# Altium project DATN.PrjPcb
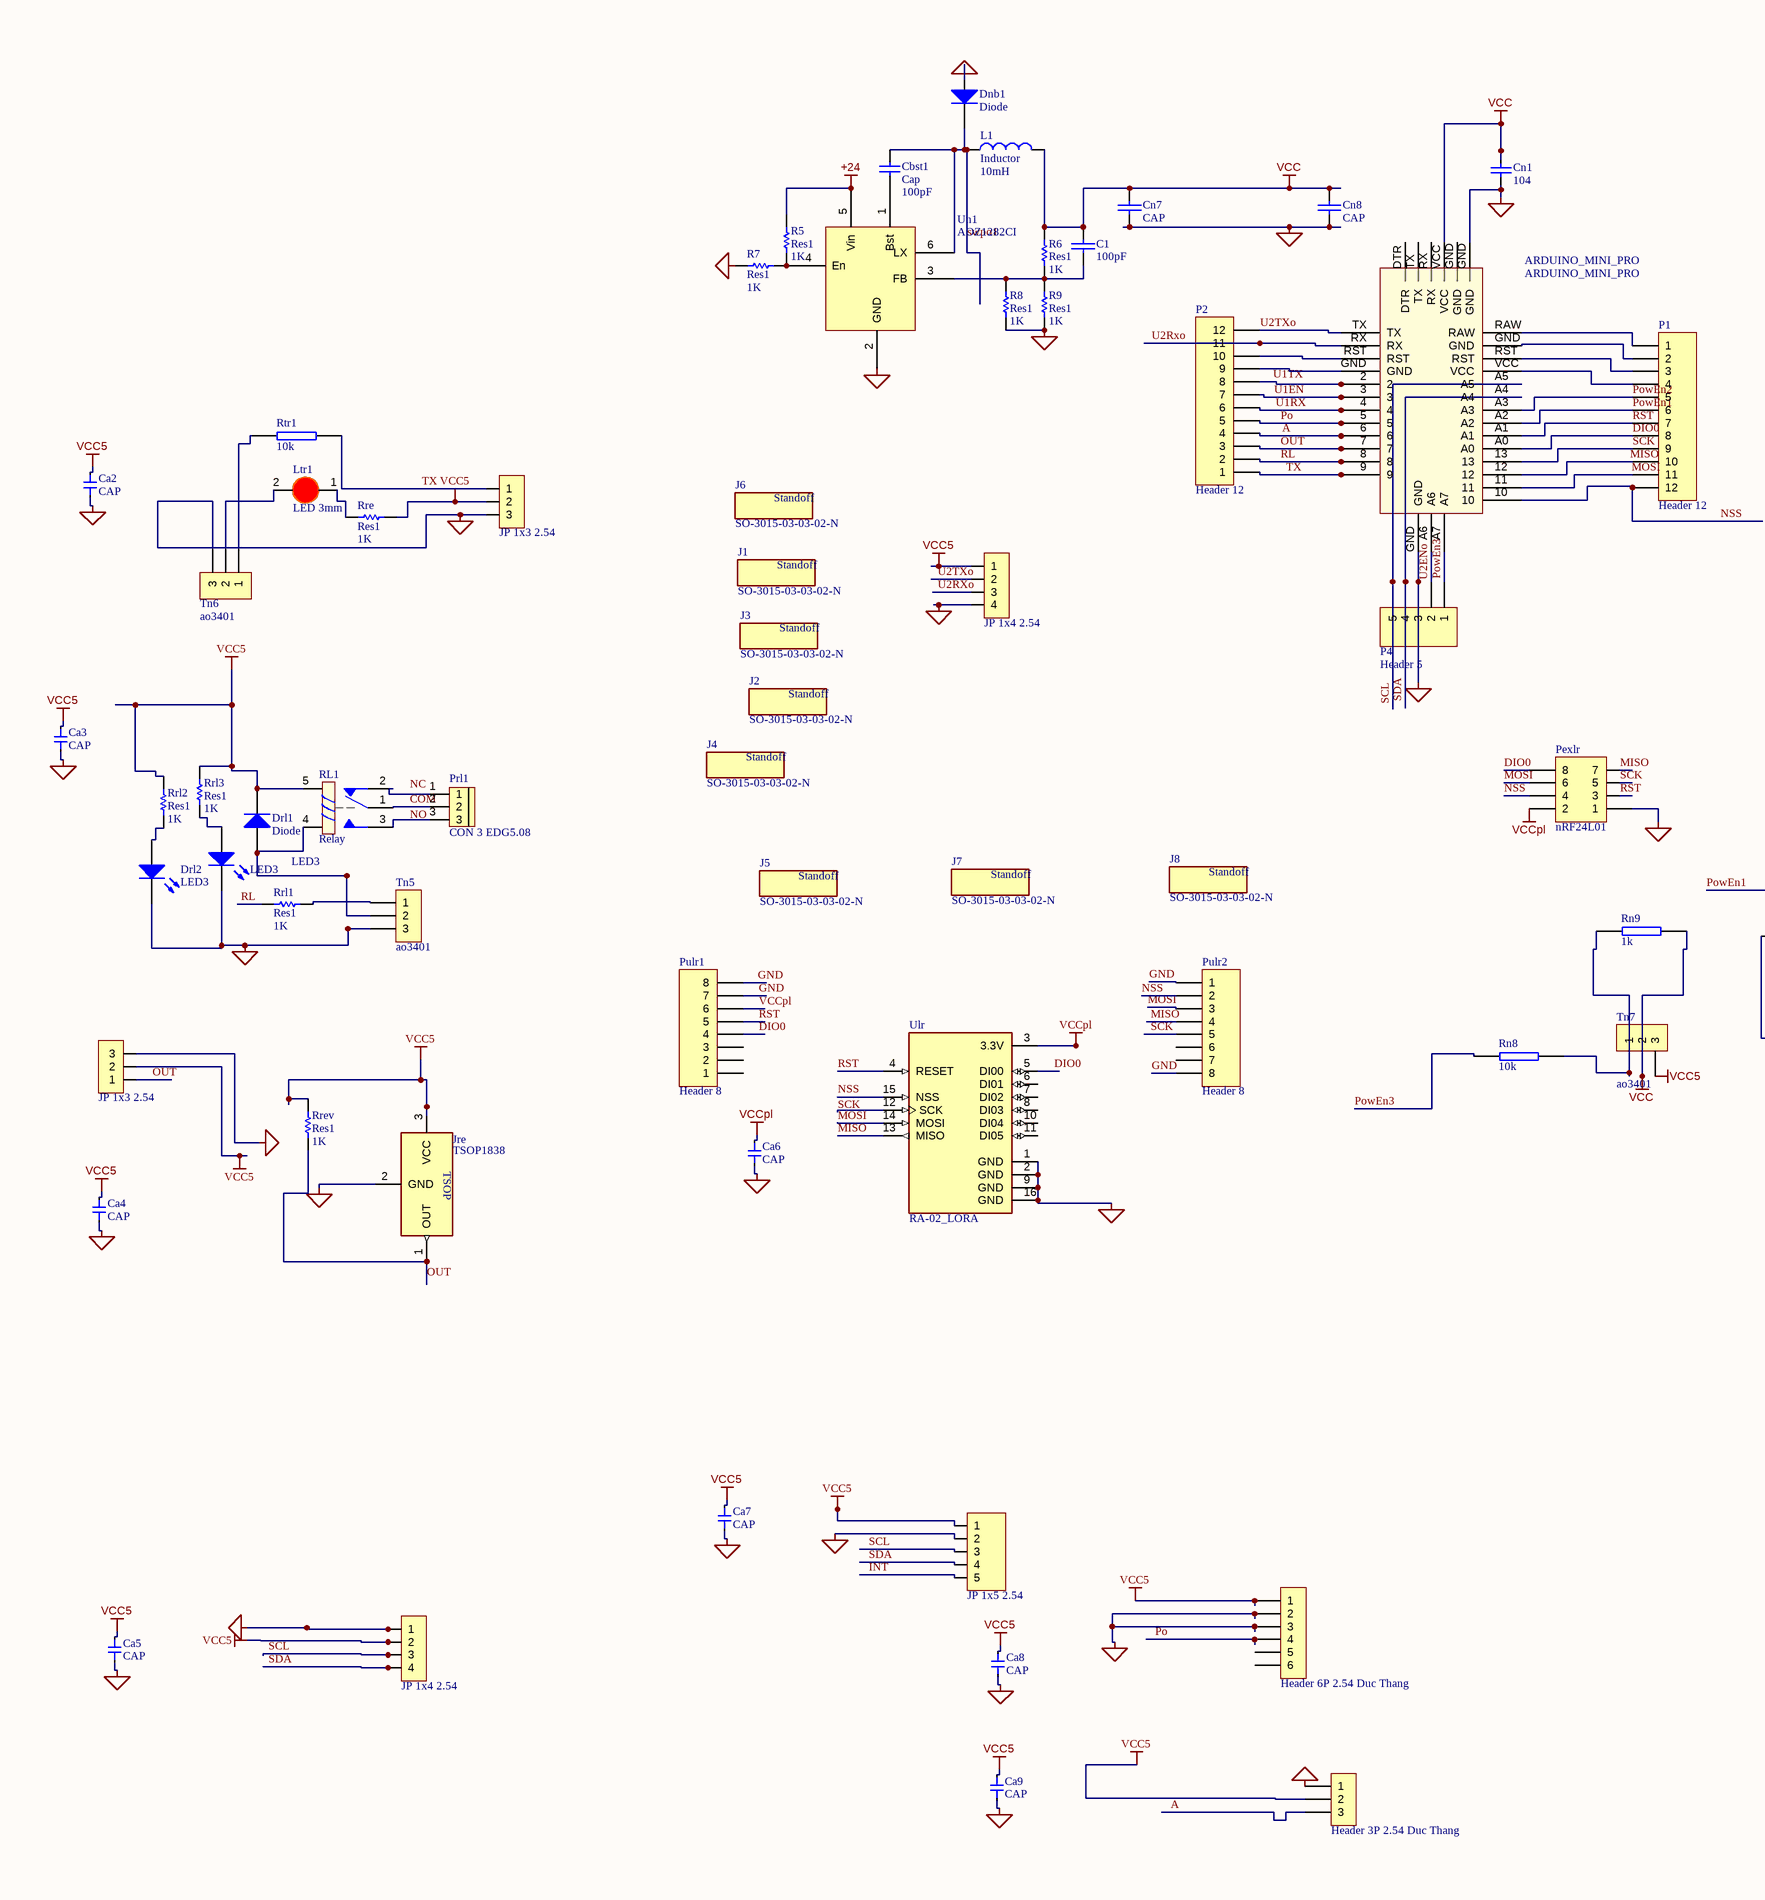
[diagram p0: Sheet1.SchDoc, left]
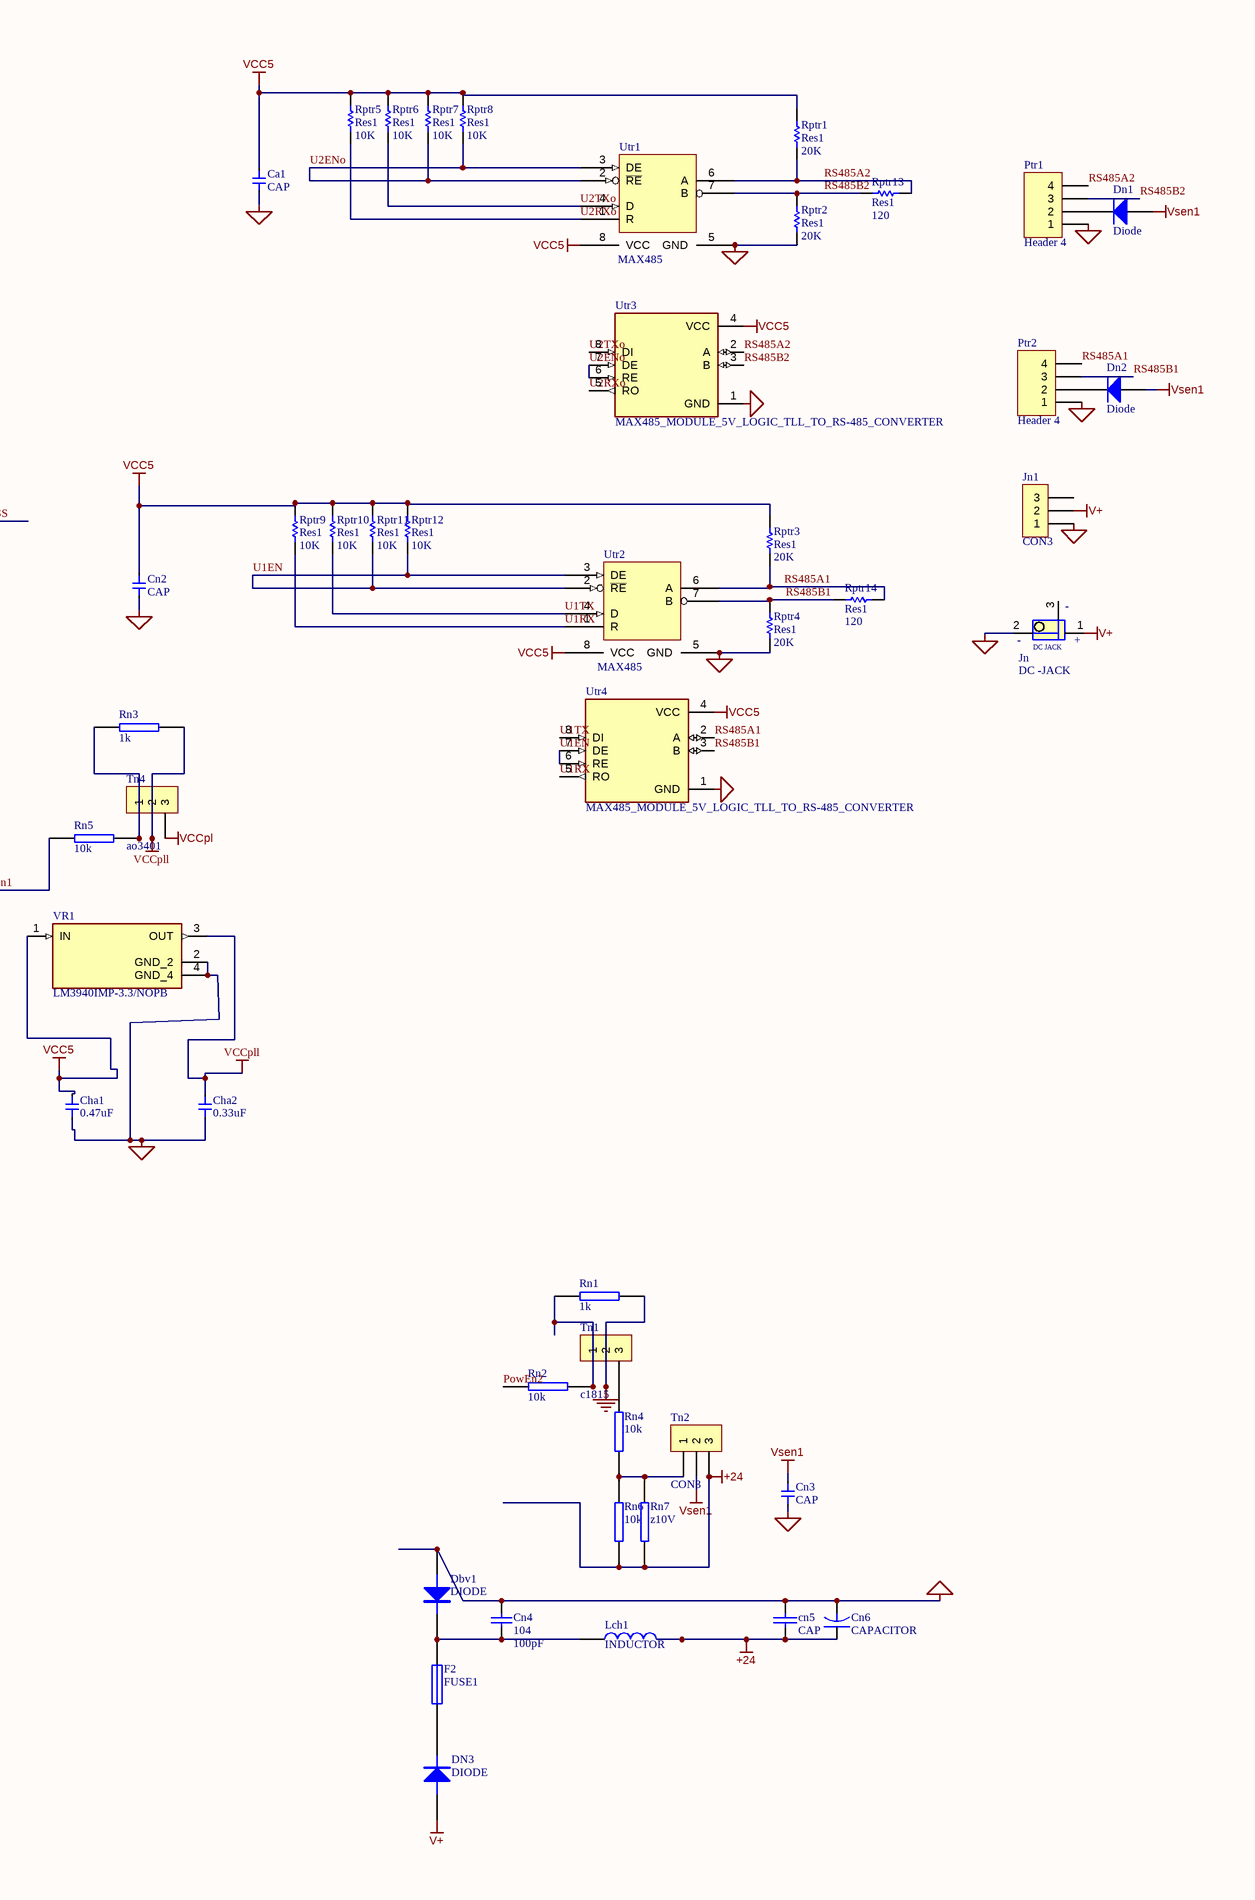
[diagram p1: Sheet1.SchDoc, right]
1 sheet, 109 parts. Net scope: global (net labels, ports and power ports of the same name join across sheets).
Board file: PCB1.PcbDoc

## Sheet Sheet1.SchDoc
size 594 x 420 mm; SheetNumber: 1; SheetTotal: 1; SPICEModelCacheKOELNJHK: <root> / <DocumentId>KOELNJHK</DocumentId> / <CacheFrame Number="0"> / <Model Name="diode" Kind="MDL"> / <Text>*Default Diode / *Diode Pinout: A,K / .MODEL DIODE D()</Text> / </Model> / </CacheFrame> / </root>

### Parts
ARDUINO_MINI_PRO  ARDUINO_MINI_PRO  [ARDUINO_MINI_PRO]
C1  100pF  [1206e]
Ca1  CAP  [Cap 0805]
Ca2  CAP  [Cap 0805]
Ca3  CAP  [Cap 0805]
Ca4  CAP  [Cap 0805]
Ca5  CAP  [Cap 0805]
Ca6  CAP  [Cap 0805]
Ca7  CAP  [Cap 0805]
Ca8  CAP  [Cap 0805]
Ca9  CAP  [Cap 0805]
Cbst1  Cap  value 100pF  [0805c]
Cha1  0.47uF  [Cap 0805]
Cha2  0.33uF  [Cap 0805]
Cn1  104  [0805c]
Cn2  CAP  [Cap 0805]
Cn3  CAP  [Cap 1206]
Cn4  104  value 100pF  [0805c]
cn5  CAP  [1206e]
Cn6  CAPACITOR  [cc15r15]
Cn7  CAP  [1206e]
Cn8  CAP  [1206e]
Dbv1  DIODE  [smb]
Dn1  Diode  [Sma]
Dn2  Diode  [Sma]
DN3  DIODE  [sma]
Dnb1  Diode  [Sma]
Drl1  Diode  [SMC]
Drl2  LED3  [3.5X2.8X1.9]
F2  FUSE1  [FuseSMD050]
H1  Header 3P 2.54 Duc Thang  [XH2.54M-3]
H2  Header 6P 2.54 Duc Thang  [XH2.54M-6]
J1  SO-3015-03-03-02-N  [SAMTEC_SO-3015-03-03-02-N]
J2  SO-3015-03-03-02-N  [SAMTEC_SO-3015-03-03-02-N]
J3  SO-3015-03-03-02-N  [SAMTEC_SO-3015-03-03-02-N]
J4  SO-3015-03-03-02-N  [SAMTEC_SO-3015-03-03-02-N]
J5  SO-3015-03-03-02-N  [SAMTEC_SO-3015-03-03-02-N]
J6  SO-3015-03-03-02-N  [SAMTEC_SO-3015-03-03-02-N]
J7  SO-3015-03-03-02-N  [SAMTEC_SO-3015-03-03-02-N]
J8  SO-3015-03-03-02-N  [SAMTEC_SO-3015-03-03-02-N]
Jn  DC -JACK  [CON3_129_PJ-002A_TH_RA]
Jn1  CON3  [giacdung3]
JPas  JP 1x5 2.54  [JP 1x5 CT]
JPrev  JP 1x3 2.54  [JP 1x3 CT]
JPsc  JP 1x4 2.54  [JP 1x4 CT]
JPsc4  JP 1x4 2.54  [JP 1x4 CT]
JPtr  JP 1x3 2.54  [JP 1x3 CT]
Jre  TSOP1838  [TSOP1838]
L1  Inductor  value 10mH  [IND_SPR06xe]
Lch1  INDUCTOR  [IND_SPR05x]
LED3  LED3  [3.5X2.8X1.9]
Ltr1  LED 3mm  [LED-3MM-RED]
P1  Header 12  [HDR1X12]
P2  Header 12  [HDR1X12]
P4  Header 5  [HDR1X5]
Pexlr  nRF24L01  [HDR2X4]
Prl1  CON 3 EDG5.08  [CON 3 3EDG5.08]
Ptr1  Header 4  [giacdung4]
Ptr2  Header 4  [giacdung4]
Pulr1  Header 8  [HDR1X8]
Pulr2  Header 8  [HDR1X8]
R5  Res1  value 1K  [0805c]
R6  Res1  value 1K  [0805c]
R7  Res1  value 1K  [0805c]
R8  Res1  value 1K  [0805c]
R9  Res1  value 1K  [0805c]
RL1  Relay  [Relay 5 Chan SRD]
Rn1  1k  [0805c]
Rn2  10k  [0805c]
Rn3  1k  [0805c]
Rn4  10k  [0805c]
Rn5  10k  [0805c]
Rn6  10k  [0805c]
Rn7  z10V  [1206]
Rn8  10k  [0805c]
Rn9  1k  [0805c]
Rptr1  Res1  value 20K  [0805c]
Rptr2  Res1  value 20K  [0805c]
Rptr3  Res1  value 20K  [0805c]
Rptr4  Res1  value 20K  [0805c]
Rptr5  Res1  value 10K  [0805c]
Rptr6  Res1  value 10K  [0805c]
Rptr7  Res1  value 10K  [0805c]
Rptr8  Res1  value 10K  [0805c]
Rptr9  Res1  value 10K  [0805c]
Rptr10  Res1  value 10K  [0805c]
Rptr11  Res1  value 10K  [0805c]
Rptr12  Res1  value 10K  [0805c]
Rptr13  Res1  value 120  [0805c]
Rptr14  Res1  value 120  [0805c]
Rre  Res1  value 1K  [0805c]
Rrev  Res1  value 1K  [0805c]
Rrl1  Res1  value 1K  [0805c]
Rrl2  Res1  value 1K  [0805c]
Rrl3  Res1  value 1K  [0805c]
Rtr1  10k  [0805c]
Tn1  c1815  [sot23-3]
Tn2  CON3  [dpak]
Tn4  ao3401  [sot23-3]
Tn5  ao3401  [sot23-3]
Tn6  ao3401  [sot23-3]
Tn7  ao3401  [sot23-3]
Ulr  RA-02_LORA  [MODULE_RA-02_LORA]
Un1  AOZ1282CI  [Sot23-6]
Utr1  MAX485  [so-8]
Utr2  MAX485  [so-8]
Utr3  MAX485_MODULE_5V_LOGIC_TLL_TO_RS-485_CONVERTER  [MODULE_MAX485_MODULE_5V_LOGIC_TLL_TO_RS-485_CONVERTER]
Utr4  MAX485_MODULE_5V_LOGIC_TLL_TO_RS-485_CONVERTER  [MODULE_MAX485_MODULE_5V_LOGIC_TLL_TO_RS-485_CONVERTER]
VR1  LM3940IMP-3.3/NOPB  [VREG_LM3940IMP-3.3/NOPB]

### Nets
+24: cn5.1 Cn6.1 Lch1.2 R5.1 Rn6.1 Rn7.1 Tn2.3 Un1.5(Vin)
GND: ARDUINO_MINI_PRO.GND Ca1.2 Ca2.2 Ca3.2 Ca4.2 Ca5.2 Ca6.2 Ca7.2 Ca8.2 Ca9.2 Cha1.2 Cha2.2 Cn1.1 Cn2.2 Cn3.2 Cn4.2 cn5.2 Cn6.2 Cn7.2 Cn8.2 Dbv1.1(A) Dnb1.1(A) Drl2.2(K) H1.1 H2.2 H2.3 Jn.2 Jn1.1 JPas.2 JPrev.3 JPsc.1 JPsc4.4 JPtr.3 Jre.2(GND) LED3.2(K) P4.3 Pexlr.1 Ptr1.1 Ptr2.1 Pulr1.7 Pulr1.8 Pulr2.1 Pulr2.8 R7.1 R8.1 R9.1 Rn1.2 Rptr2.1 Rptr4.1 Tn1.2 Tn5.3 Tn6.3 Ulr.1(GND) Ulr.2(GND) Ulr.9(GND) Ulr.16(GND) Un1.2(GND) Utr1.5(GND) Utr2.5(GND) Utr3.1(GND) Utr4.1(GND) VR1.2(GND_2) VR1.4(GND_4)
V+: DN3.1(A) Jn.1 Jn1.2
VCC: ARDUINO_MINI_PRO.VCC C1.1 Ca1.1 Ca2.1 Ca3.1 Ca4.1 Ca5.1 Ca7.1 Ca8.1 Ca9.1 Cha1.1 Cn1.2 Cn2.1 Cn7.1 Cn8.1 Drl1.2(K) H1.2 H2.1 JPas.1 JPrev.2 JPsc.2 JPsc4.1 JPtr.2 Jre.3(VCC) L1.2 R6.1 RL1.5 Rn9.2 Rptr1.1 Rptr3.1 Rptr5.1 Rptr6.1 Rptr7.1 Rptr8.1 Rptr9.1 Rptr10.1 Rptr11.1 Rptr12.1 Rre.2 Rrev.2 Rrl2.2 Rrl3.2 Tn7.2 Tn7.3 Utr1.8(VCC) Utr2.8(VCC) Utr3.4(VCC) Utr4.4(VCC) VR1.1(IN)  [also labelled VCC5]
VCCpl: Ca6.1 Pexlr.2 Pulr1.6 Tn4.3 Ulr.3(3.3V)
VCCpll: Cha2.1 Rn3.2 Tn4.2 VR1.3(OUT)
Vsen1: Cn3.1 Dn1.1(A) Dn2.1(A) Tn2.2
A: ARDUINO_MINI_PRO.6 H1.3 P2.4
COM: Prl1.2 RL1.1
DIO0: ARDUINO_MINI_PRO.A0 P1.8 Pexlr.8 Pulr1.4 Ulr.5(DI00)
INT: JPas.5
MISO: ARDUINO_MINI_PRO.12 P1.10 Pexlr.7 Pulr2.4 Ulr.13(MISO)
MOSI: ARDUINO_MINI_PRO.11 P1.11 Pexlr.6 Pulr2.3 Ulr.14(MOSI)
NSS: ARDUINO_MINI_PRO.10 P1.12 Pexlr.4 Pulr2.2 Ulr.15(NSS)
OUT: ARDUINO_MINI_PRO.7 JPrev.1 Jre.1(OUT) P2.3 Rrev.1
Po: ARDUINO_MINI_PRO.5 H2.4 P2.5
PowEn1: ARDUINO_MINI_PRO.A2 P1.6 Rn5.1
PowEn2: ARDUINO_MINI_PRO.A3 P1.5 Rn2.1
PowEn3: ARDUINO_MINI_PRO.A7 P4.1 Rn8.1
RL: ARDUINO_MINI_PRO.8 P2.2 Rrl1.1
RS485A1: Ptr2.4 Rptr3.2 Rptr14.2 Utr2.6(A) Utr4.2(A)
RS485A2: Ptr1.4 Rptr1.2 Rptr13.2 Utr1.6(A) Utr3.2(A)
RS485B1: Ptr2.3 Rptr4.2 Rptr14.1 Utr2.7(B) Utr4.3(B)
RS485B2: Ptr1.3 Rptr2.2 Rptr13.1 Utr1.7(B) Utr3.3(B)
RST: ARDUINO_MINI_PRO.A1 P1.7 Pexlr.3 Pulr1.5 Ulr.4(RESET)
SCK: ARDUINO_MINI_PRO.13 P1.9 Pexlr.5 Pulr2.5 Ulr.12(SCK)
SCL: ARDUINO_MINI_PRO.A5 JPas.3 JPsc.3 P4.5
SDA: ARDUINO_MINI_PRO.A4 JPas.4 JPsc.4 P4.4
swpo1: Cbst1.2 Dnb1.2(K) L1.1 Un1.6(LX)
TX: ARDUINO_MINI_PRO.9 JPtr.1 P2.1 Rtr1.2
U1EN: ARDUINO_MINI_PRO.3 P2.7 Rptr11.2 Rptr12.2 Utr2.2(~{RE}) Utr2.3(DE) Utr4.6(RE) Utr4.7(DE)
U1RX: ARDUINO_MINI_PRO.4 P2.6 Rptr9.2 Utr2.1(R) Utr4.5(RO)
U1TX: ARDUINO_MINI_PRO.2 P2.8 Rptr10.2 Utr2.4(D) Utr4.8(DI)
U2ENo: ARDUINO_MINI_PRO.A6 P4.2 Rptr7.2 Rptr8.2 Utr1.2(~{RE}) Utr1.3(DE) Utr3.6(RE) Utr3.7(DE)
U2RXo: ARDUINO_MINI_PRO.RX JPsc4.3 P2.11 Rptr5.2 Utr1.1(R) Utr3.5(RO)
U2TXo: ARDUINO_MINI_PRO.TX JPsc4.2 P2.12 Rptr6.2 Utr1.4(D) Utr3.8(DI)
NetARDUINO_MINI_PRO_GND: ARDUINO_MINI_PRO.GND P1.2
NetARDUINO_MINI_PRO_GND: ARDUINO_MINI_PRO.GND P2.9  [a separate net that carries the same name]
NetARDUINO_MINI_PRO_RAW: ARDUINO_MINI_PRO.RAW P1.1
NetARDUINO_MINI_PRO_RST: ARDUINO_MINI_PRO.RST P1.3
NetARDUINO_MINI_PRO_RST: ARDUINO_MINI_PRO.RST P2.10  [a separate net that carries the same name]
NetARDUINO_MINI_PRO_VCC: ARDUINO_MINI_PRO.VCC P1.4
NetC1_2: C1.2 R6.2 R8.2 R9.2 Un1.3(FB)
NetCbst1_1: Cbst1.1 Un1.1(Bst)
NetCn4_1: Cn4.1 Dbv1.2(K) F2.2 Lch1.1
NetDn1_2: Dn1.2(K) Ptr1.2
NetDn2_2: Dn2.2(K) Ptr2.2
NetDN3_2: DN3.2(K) F2.1
NetDrl1_1: Drl1.1(A) RL1.4 Tn5.2
NetDrl2_1: Drl2.1(A) Rrl2.1
NetLED3_1: LED3.1(A) Rrl3.1
NetLtr1_1: Ltr1.1(A) Rre.1
NetLtr1_2: Ltr1.2(K) Tn6.2
NetPrl1_1: Prl1.1 RL1.2
NetPrl1_3: Prl1.3 RL1.3
NetR5_2: R5.2 R7.2 Un1.4(En)
NetRn1_1: Rn1.1 Rn2.2 Tn1.1
NetRn3_1: Rn3.1 Rn5.2 Tn4.1
NetRn4_1: Rn4.1 Tn1.3
NetRn4_2: Rn4.2 Rn6.2 Rn7.2 Tn2.1
NetRn8_2: Rn8.2 Rn9.1 Tn7.1
NetRrl1_2: Rrl1.2 Tn5.1
NetRtr1_1: Rtr1.1 Tn6.1

Not connected (* = marked no-connect by the designer): ARDUINO_MINI_PRO DTR; H2 5 6; Jn 3(-); Jn1 3; Pulr1 1 2 3; Pulr2 6 7; Ulr 6(DI01) 7(DI02) 8(DI03) 10(DI04) 11(DI05)

### Notes on the sheet
- Labels drawn without touching a wire or pin: NC, NO
- DWG NO:
- REV:
- THIS DOCUMENT AND THE DATA DISCLOSED HEREIN OR
- HEREWITH IS THE PROPERTY OF ALTIUM LIMITED AND MAY
- BE FREELY DISTRIBUTED IN WHOLE. NO RIGHTS ARE
- RESERVED OR EXPRESS OR IMPLIED WARANTEE GIVEN.
- REVISION
- DESCRIPTION
- DATE
- APPROVED
- ENG:
- APPROVALS
- PROJECT
- DSN:
- CHK:
- REFERENCE DOCUMENTS
- PROJECT REVISION:
- TITLE
- DOCUMENT REVISION:
- DESIGN ITEM:
- BOM:
- FAB DWG:
- PCB DWG:
- ASSY DWG:
- SCALE:
- A2
- SIZE
- CAGE CODE
- FILE NAME
- DWG NO.
- SHEET
- OF
- REV
- (in symbol CON-PLG_3X1-228-DC_JACK) +; DC JACK
- (in symbol SO-3015-03-03-02-N) Standoff
- (in symbol TSOP1838) TSOP

### Library data of the parts
C1 cn5 Cn7 Cn8 = CAP: Capacitor
Ca1-Ca9 Cha1 Cha2 Cn2 = Cap 0805: Capacitor SMD 0805
Cbst1 Cn1 Cn4 = Cap: Capacitor; Published: 8-Jun-2000; LatestRevisionDate: 17-Jul-2002; LatestRevisionNote: Re-released for DXP Platform.; PackageReference: RAD-0.3; Publisher: Altium Limited
Cn3 = Cap 1206: Capacitor SMD 1206
Dn1 Dn2 Dnb1 Drl1 = Diode: Default Diode; Published: 8-Jun-2000; LatestRevisionDate: 17-Jul-2002; LatestRevisionNote: Re-released for DXP Platform.; PackageVersion: Sep-1996; PackageReference: SMC; Publisher: Altium Limited; Code_JEDEC: DO-214-AB
  Drl1: PackageDescription: DO-214-AB/SMC; 2 C-Bend Leads; Body 7.9 x 5.9 mm, inc. leads (LxW)
Drl2 LED3 = LED3: Typical BLUE SiC LED; Published: 8-Jun-2000; LatestRevisionDate: 17-Dec-2003; LatestRevisionNote: PCB Footprint replaced.; DatasheetVersion: 16-Apr-2002; PackageVersion: 16-Apr-2002; PackageReference: 3.5X2.8X1.9; Publisher: Altium Limited; PackageDescription: SM LED; 2 C-Bend Leads; Body 3.5 x 2.8 x 1.9 mm, inc leads (LxWxH typ)
F2 = FUSE1: Fuse
H1 = Header 3P 2.54 Duc Thang: Cắm; Ten_Linh_Kien: Header 3P XH2.54-3P Đực Thẳng; Don_Vi: Con; Ma_Hang: MH001292; Chung_Loai: Cắm
H2 = Header 6P 2.54 Duc Thang: Cắm; Ten_Linh_Kien: Header 6P XH2.54-6P Đực Thẳng; Don_Vi: Con; Ma_Hang: MH001972; Chung_Loai: Cắm
J1-J8 = SO-3015-03-03-02-N: Precision Board Stacking Standoff; MF: Samtec; SnapEDA_Link: https://www.snapeda.com/parts/SO-3015-03-03-02-N/Samtec/view-part/?ref=snap; Package: None; Value: *; MP: SO-3015-03-03-02-N; Check_prices: https://www.snapeda.com/parts/SO-3015-03-03-02-N/Samtec/view-part/?ref=eda
Jn = CON-PLG_3X1-228-DC_JACK: 3 Pins, 1 Row 228mil Pitch, right angle Connector, male; Manufacturer: JST; Manufacturer Part Number: PJ-002A; Alternate Part Number-1: NA; Case/Package: TH-CON; Supplier-1: SP ROAD; Supplier Part Number-1: NA
Jn1 Tn1 Tn2 Tn4-Tn7 = CON3: Connector
JPas = JP 1x5 2.54 Cai Thang: Cắm; Ten_Linh_Kien: Jump Đơn Cái 2.54MM 1x20P Thẳng; Don_Vi: Con; Ma_Hang: MH004006; Ghi_Chu: *; Kieu_Chan: *; Chung_Loai: Cắm
JPrev JPtr = JP 1x3 2.54 Cai Thang: Cắm; Ten_Linh_Kien: Jump Đơn Cái 2.54MM 1x20P Thẳng; Don_Vi: Con; Ma_Hang: MH004006; Ghi_Chu: *; Kieu_Chan: *; Chung_Loai: Cắm
JPsc JPsc4 = JP 1x4 2.54 Cai Thang: Cắm; Ten_Linh_Kien: Jump Đơn Cái 2.54MM 1x20P Thẳng; Don_Vi: Con; Ma_Hang: MH004006; Ghi_Chu: *; Kieu_Chan: *; Chung_Loai: Cắm
Jre = TSOP1838: IR Remote Receiver 38KHz 35m 3-Pin; MF: Vishay; SnapEDA_Link: https://www.snapeda.com/parts/TSOP1838/Vishay/view-part/?ref=snap; Package: None; Value: *; MP: TSOP1838; Check_prices: https://www.snapeda.com/parts/TSOP1838/Vishay/view-part/?ref=eda
L1 = Inductor: Code_IEC: 1005; Published: 8-Jun-2000; LatestRevisionDate: 29-May-2009; LatestRevisionNote: IPC-7351 Footprint Added.; PackageReference: 0402-A; Publisher: Altium Limited; PackageDescription: Chip Inductor; Code_JEITA: 0402
Ltr1 = LED 3mm Do: Cắm; Don_Vi: Con; Ma_Hang: MH003892; Ten_Linh_Kien: Led 3MM Phủ Đỏ (10c); Ghi_Chu: *; Kieu_Chan: *; Chung_Loai: Cắm
P1 P2 = Header 12: Header, 12-Pin; LatestRevisionDate: 17-Jul-2002; LatestRevisionNote: Re-released for DXP Platform.; Publisher: Altium Limited
P4 = Header 5: Header, 5-Pin; LatestRevisionDate: 17-Jul-2002; LatestRevisionNote: Re-released for DXP Platform.; Publisher: Altium Limited
Pexlr = Header 4X2: Header, 4-Pin, Dual row; LatestRevisionDate: 17-Jul-2002; LatestRevisionNote: Re-released for DXP Platform.; Publisher: Altium Limited
Prl1 = CON 3 EDG5.08: Cắm; Ten_Linh_Kien: CON 3 2EDG5.08-3P 5.08MM ( Xanh Cong); Ma_Hang: MH000760; Ghi_Chu: *; Kieu_Chan: *; Don_Vi: Con; Chung_Loai: Cắm
Ptr1 Ptr2 = Header 4: Header, 4-Pin; LatestRevisionDate: 17-Jul-2002; LatestRevisionNote: Re-released for DXP Platform.; Publisher: Altium Limited
Pulr1 Pulr2 = Header 8: Header, 8-Pin; LatestRevisionDate: 17-Jul-2002; LatestRevisionNote: Re-released for DXP Platform.; Publisher: Altium Limited
R5-R9 Rptr1-Rptr14 Rre Rrev Rrl1-Rrl3 = Res1: Resistor; Published: 8-Jun-2000; LatestRevisionDate: 17-Jul-2002; LatestRevisionNote: Re-released for DXP Platform.; PackageReference: AXIAL-0.3; Publisher: Altium Limited
RL1 = Relay 5 Chan SRD: Relay 5 Chan; Ma_Hang: MH009374; Ten: Relay 5V10A SRD-05VDC-SL-C Chính Hãng
Rn1-Rn9 Rtr1 = RES2
Ulr = RA-02_LORA: Ra-02 LoRa RF M5Stack Platform Evaluation Expansion Board; Price: None; Availability: Unavailable; MP: RA-02_LORA; Value: *; Package: None
Un1 = AOZ1282CI: AOZ1282
Utr1 Utr2 = DS36F95: DIFFERENTIAL BUS TRANSCEIVERS
Utr3 Utr4 = MAX485_MODULE_5V_LOGIC_TLL_TO_RS-485_CONVERTER: 5V MAX485 TTL To RS485 Converter Module Board for Arduino; MP: MAX485 Module 5V logic TLL to RS-485 converter; MF: e-Gizmo Mechatronix Central; Value: *; SnapEDA_Link: https://www.snapeda.com/parts/MAX485%20Module%205V%20logic%20TLL%20to%20RS-485%20converter/e-Gizmo+Mechatronix+Central/view-part/?ref=snap; Package: Package; Availability: Not in stock; Check_prices: https://www.snapeda.com/parts/MAX485%20Module%205V%20logic%20TLL%20to%20RS-485%20converter/e-Gizmo+Mechatronix+Central/view-part/?ref=eda; Price: None
VR1 = LM3940IMP-3.3/NOPB: 1-A, low-dropout voltage regulator for 5-V to 3.3-V conversion 4-SOT-223 -40 to 125; MF: Texas Instruments; SnapEDA_Link: https://www.snapeda.com/parts/LM3940IMP-3.3/Texas+Instruments/view-part/?ref=snap; Package: SOT-223-4 Texas Instruments; Value: *; MP: LM3940IMP-3.3; Check_prices: https://www.snapeda.com/parts/LM3940IMP-3.3/Texas+Instruments/view-part/?ref=eda